# EAGLE schematic WirelessReceiver (EAGLE 9.6.2)
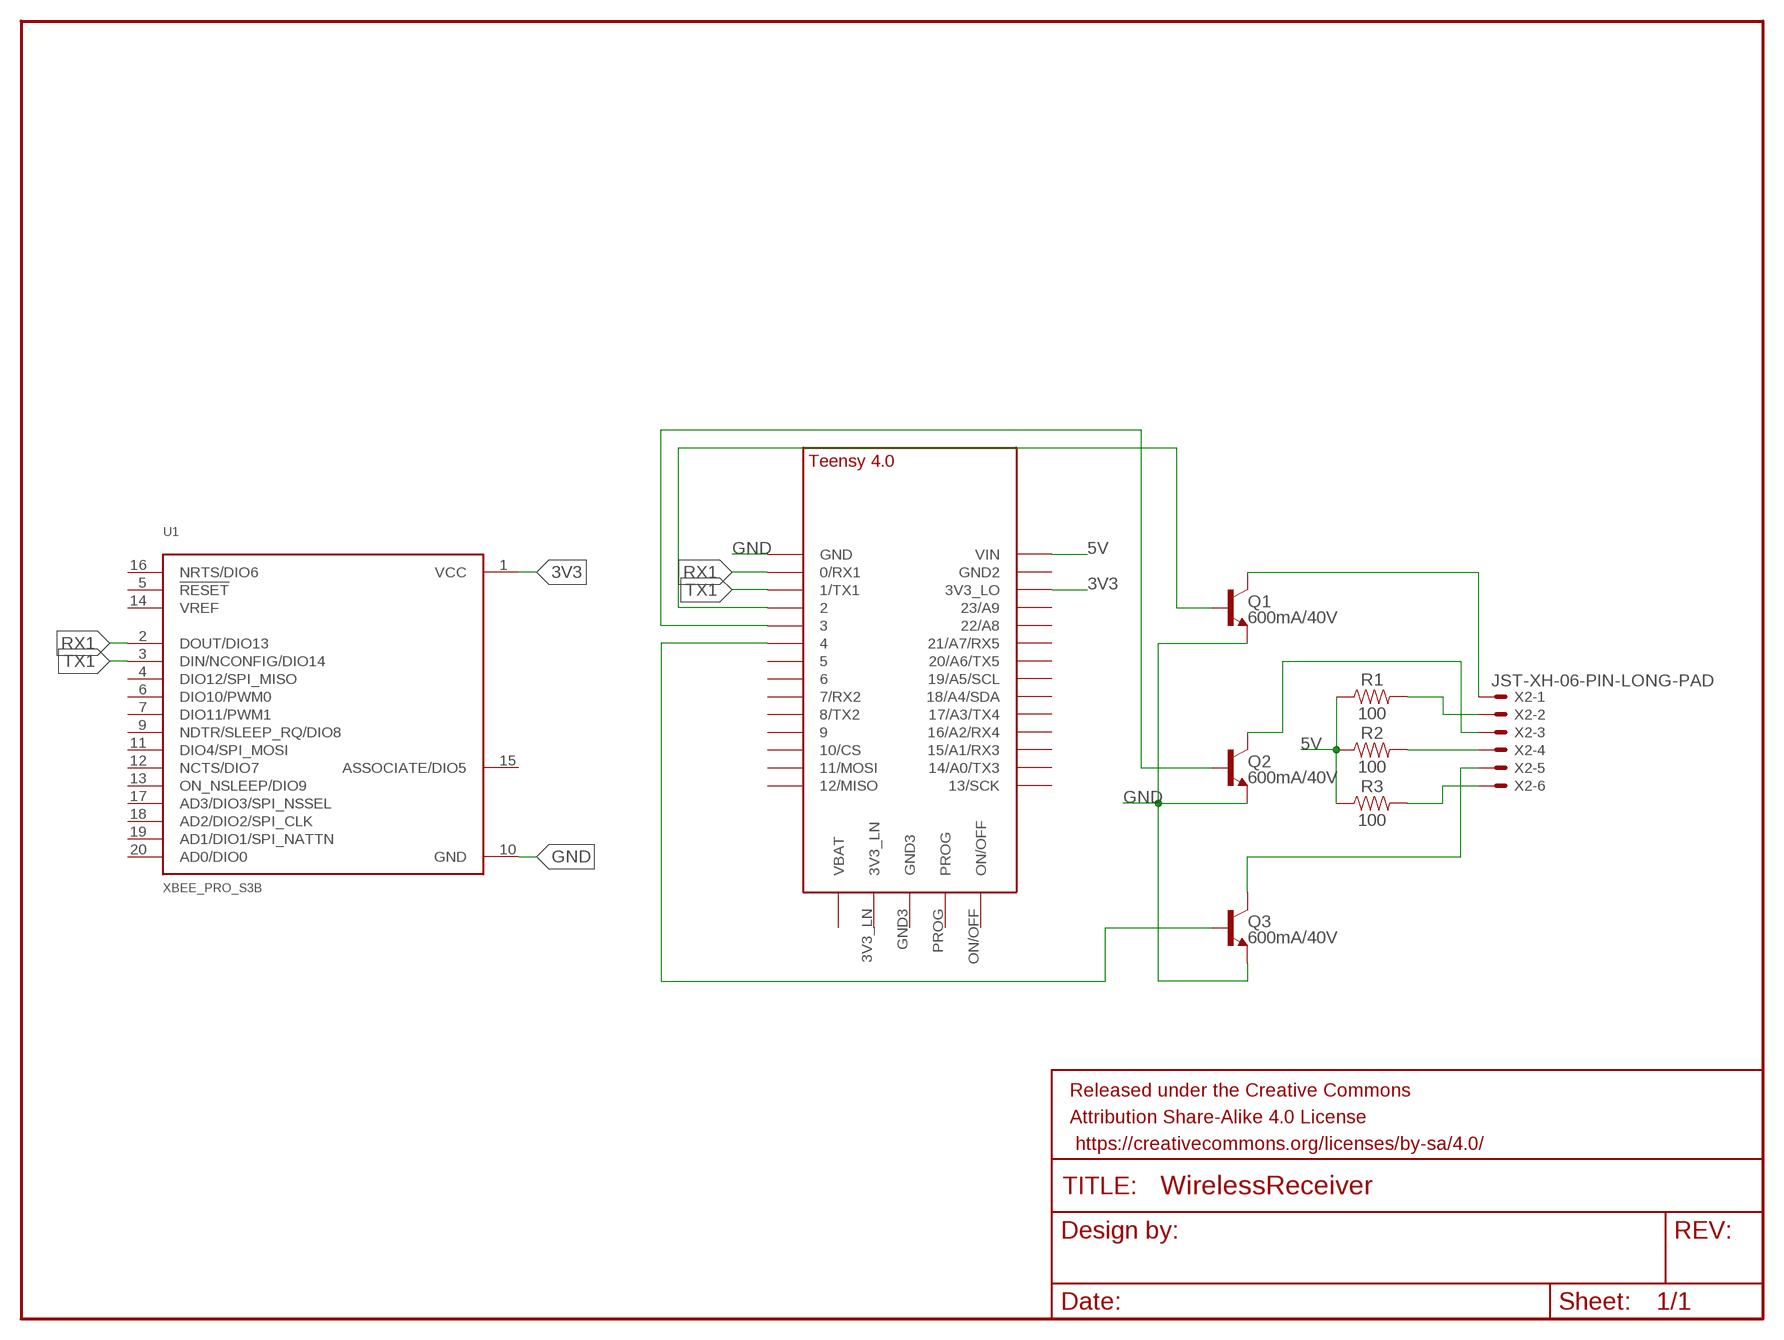
[diagram p0: schematic, sheet 1]

## Parts
FRAME1  FRAME-LETTERNO_PACKAGE  [DUMMY]
Q1  600mA/40V  TRANS_NPN-MMBT2222AL  [SOT23-3]
Q2  600mA/40V  TRANS_NPN-MMBT2222AL  [SOT23-3]
Q3  600mA/40V  TRANS_NPN-MMBT2222AL  [SOT23-3]
R1  100  100OHM-HORIZ-1/4W-1%  [AXIAL-0.3]
R2  100  100OHM-HORIZ-1/4W-1%  [AXIAL-0.3]
R3  100  100OHM-HORIZ-1/4W-1%  [AXIAL-0.3]
U1  XBEE_PRO_S3B  [XBEE_PRO_S3B]
U$1  TEENSY_4.0-BASIC  [TEENSY_4.0-BASIC]
X2  JST-XH-06-PIN-LONG-PAD  [JST-XH-06-PACKAGE-LONG-PAD]

## Nets
3V3: U1.1(VCC) U$1.3V3_LO
5V: R1.P$1 R2.P$1 R3.P$1 U$1.VIN
GND: Q1.2(E) Q2.2(E) Q3.2(E) U1.10(GND) U$1.GND
N$3: R1.P$2 X2.2
N$4: R2.P$2 X2.4
N$5: R3.P$2 X2.6
N$6: Q1.3(C) X2.1
N$7: Q2.3(C) X2.3
N$8: Q3.3(C) X2.5
N$9: Q1.1(B) U$1.2
N$10: Q2.1(B) U$1.3/CANTX
N$11: Q3.1(B) U$1.4/CANRX
RX1: U1.2(DOUT/DIO13) U$1.0/RX(0/RX1)
TX1: U1.3(DIN/NCONFIG/DIO14) U$1.1/TX(1/TX1)
Unconnected: U1.4(DIO12/SPI_MISO) U1.5(!RESET) U1.6(DIO10/PWM0) U1.7(DIO11/PWM1) U1.9(NDTR/SLEEP_RQ/DIO8) U1.11(DIO4/SPI_MOSI) U1.12(NCTS/DIO7) U1.13(ON_NSLEEP/DIO9) U1.14(VREF) U1.15(ASSOCIATE/DIO5) U1.16(NRTS/DIO6) U1.17(AD3/DIO3/SPI_NSSEL) U1.18(AD2/DIO2/SPI_CLK) U1.19(AD1/DIO1/SPI_NATTN) U1.20(AD0/DIO0) U$1.3V3_LN U$1.5 U$1.6 U$1.7(7/RX2) U$1.8(8/TX2) U$1.9/CS U$1.10/CS U$1.11/MOSI U$1.12/MISO U$1.13/SCK U$1.14/A0(14/A0/TX3) U$1.15/A1(15/A1/RX3) U$1.16/A2(16/A2/RX4) U$1.17/A3(17/A3/TX4) U$1.18/A4/SDA U$1.19/A5/SCL U$1.20/A6(20/A6/TX5) U$1.21/A7(21/A7/RX5) U$1.22/A8 U$1.23/A9 U$1.GND2 U$1.GND3 U$1.ON/OFF U$1.PROG U$1.VBAT\(VBAT)

## Library data of the parts
FRAME1 = SparkFun-Aesthetics:FRAME-LETTER: Schematic Frame - Letter Standard 8.5x11 US Letter frame; DESIGNER: Nobody; VERSION: v01
Q1-Q3 = SparkFun-DiscreteSemi:TRANS_NPN: NPN transistor Current controlled devices typically used to amplify current or used as a switch. BC547 - COM-08928 <http://www.sparkfun.com/products/8928> (TO-92 45V 100mA) (1.Collector 2.Base 3.Emitter) 2N3904 - COM-00521 <http://www.sparkfun.com/products/521> (TO-92 40V 200mA) (1.Emitter 2.Base 3.Collector) P2N2222A - COM-12852 <http://www.sparkfun.com/products/12852> (TO-92 40V 600mA) (1.Collector 2.Base 3.Emitter); PROD_ID: TRANS-08049
R1-R3 = SparkFun-Resistors:100OHM: 100Ω resistor A resistor is a passive two-terminal electrical component that implements electrical resistance as a circuit element. Resistors act to reduce current flow, and, at the same time, act to lower voltage levels within circuits. - Wikipedia; PROD_ID: RES-12181
U1 = GTOR - Microcontroller:XBEE_PRO_S3B: XBee-PRO 900HP DigiMesh 900 MHz 200 Kbps RF Module with U.FL Connector; DESCRIPTION: General ISM < 1GHz Transceiver Module 900MHz Antenna Not Included, RP-SMA Through Hole; DIGI-KEY_PART_NUMBER: 602-1293-ND; MF: Digi International; MP: XBP9B-XCST-001; PACKAGE: Module Digi International
U$1 = Teensy-4.0:TEENSY_4.0-BASIC
X2 = Rembrandt Electronics - JST XH Connectors v1-0:JST-XH-06-PIN: JST XH Connector 2 Pin Wire to board connector. Pitch: 2,54 mm, (0.100") Number of pins: 6 Created by Rembrandt Electronics www.rembrandtelectronics.com